# Altium schematic sheet LTM455_sch.SchDoc
size A4; Organization1: VINCULADA AO EXÉRCITO BRASILEIRO; Organization2: FÁBRICA DE MATERIAL DE; Organization3: COMUNICAÇÕES E ELETRÔNICA; Organization0: INDÚSTRIA DE MATERIAL BÉLICO DO BRASIL; Esquematico: Esquemático
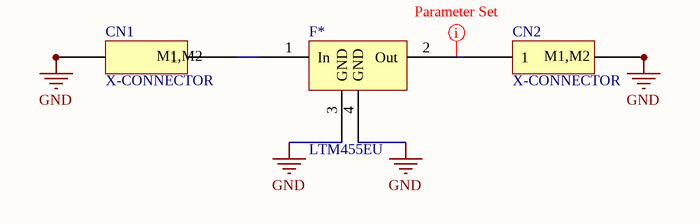
[diagram p0: LTM455_sch.SchDoc]

## Parts
CN1  X-CONNECTOR  [X-CONNECTOR-PCB]
CN2  X-CONNECTOR  [X-CONNECTOR-PCB]
F*  LTM455EU  [New footprint 1]

## Nets
GND: CN1.M1 CN1.M2 CN2.M1 CN2.M2 F*.3(GND) F*.4(GND)
NetCN1_1: CN1.1 F*.1(In)
NetCN2_1: CN2.1 F*.2(Out)

## Layout directives
net class 50ohm: NetCN2_1

## Notes on the sheet
- USADO EQUIP.:
- DATA:
- ENG:
- VERIF:
- HORA:
- REV:
- APROV:
- TÍTULO:
- FOLHA:
- /
- FORMATO:
- A4
- CÓDIGO:
- ESTOQUE:
- (in symbol X-CONNECTOR-5) M1,M2

## Library data of the parts
CN1 CN2 = X-CONNECTOR-5: CONECTOR PARA MÓDULOS X MICROWAVE; RoHS: Yes; Mount: TH
F* = LTM455EU-01.A.1: Ceramic band pass filter fc = 455khz